# EAGLE schematic bike-blinky (EAGLE 6.4)
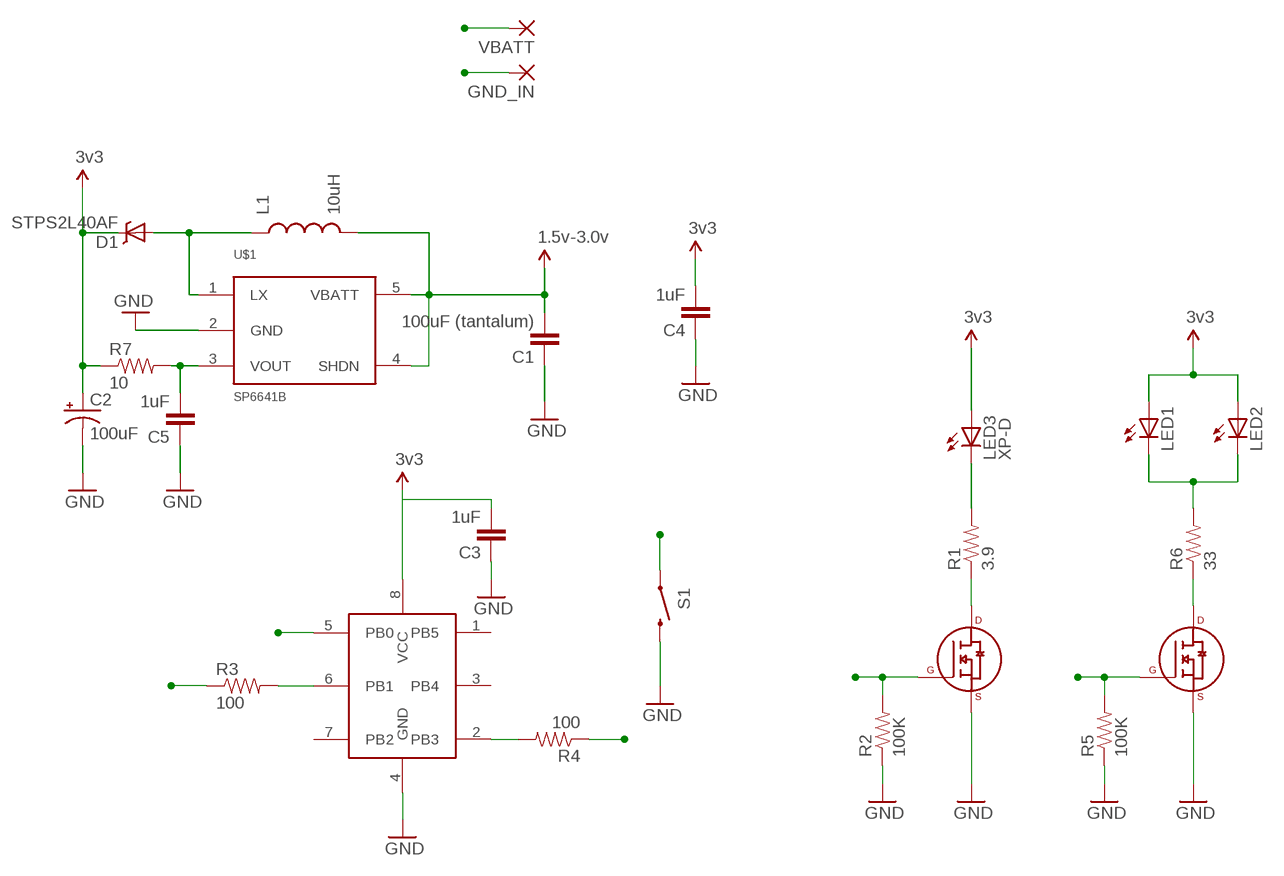
[diagram p0: schematic, sheet 1]

## Parts
C1  100uF (tantalum)  CAP1206  [1206]
C2  100uF  CAP_POLC  [PANASONIC_C]
C3  1uF  CAP0603-CAP  [0603-CAP]
C4  1uF  CAP0603-CAP  [0603-CAP]
C5  1uF  CAP0603-CAP  [0603-CAP]
D1  STPS2L40AF  MBRA140  [SMA-DIODE]
GND_IN  WIREPAD2,54/1,0  [2,54/1,0]
L1  10uH  INDUCTOR1007  [1007]
LED1  LED3MM  [LED3MM]
LED2  LED3MM  [LED3MM]
LED3  XP-D  XLAMP-XB-D-LED  [XB-D-REV1]
R1  3.9  RESISTOR0603-RES  [0603-RES]
R2  100K  RESISTOR0603-RES  [0603-RES]
R3  100  RESISTOR0603-RES  [0603-RES]
R4  100  RESISTOR0603-RES  [0603-RES]
R5  100K  RESISTOR0603-RES  [0603-RES]
R6  33  RESISTOR0603-RES  [0603-RES]
R7  10  RESISTOR0603-RES  [0603-RES]
S1  SWITCH-MOMENTARY-2SMD-2  [TACTILE_SWITCH_SMD-2]
U$1  SP6641B  SP6641SP6641A/B  [SOT23-5]
U$2  ATTINY13  [WSOIC-8]
U$7  NDS351AN  [SOT-23-3]
U$8  NDS351AN  [SOT-23-3]
VBATT  WIREPAD2,54/1,0  [2,54/1,0]

## Nets
5V: C2.+ C3.2 C4.2 D1.C LED1.A LED2.A LED3.A R7.1 U$2.8(VCC) ; supply symbol labelled 3v3
GND: C1.1 C2.- C3.1 C4.1 C5.1 GND_IN.1(P) R2.1 R5.1 S1.1 U$1.2(GND) U$2.4(GND) U$7.2(S) U$8.2(S)
GND_OUT: R1.1 U$8.3(D)
GND_OUT1: R6.1 U$7.3(D)
N$2: R3.2 U$2.6(PB1)
N$3: D1.A L1.1 U$1.1(LX)
N$4: LED1.K(C) LED2.K(C) R6.2
N$5: LED3.C R1.2
N$6: R4.2 U$2.2(PB3)
N$7: C5.2 R7.2 U$1.3(VOUT)
RED: R2.2 R3.1 U$8.1(G)
SW: S1.2 U$2.5(PB0)
VBATT: C1.2 L1.2 U$1.4(SHDN) U$1.5(VBATT) VBATT.1(P) ; supply symbol labelled 1.5v-3.0v
YEL: R4.1 R5.2 U$7.1(G)
Unconnected: U$2.1(PB5) U$2.3(PB4) U$2.7(PB2)

## Library data of the parts
C1 C3-C5 = SparkFun:CAP: Capacitor Standard 0603 ceramic capacitor, and 0.1" leaded capacitor.
C2 = SparkFun-Capacitors:CAP_POL: Capacitor Polarized These are standard SMD and PTH capacitors. Normally 10uF, 47uF, and 100uF in electrolytic and tantalum varieties. Always verify the external diameter of the through hole cap, it varies with capacity, voltage, and manufacturer. The EIA devices should be standard.
D1 = SparkFun-DiscreteSemi:MBRA140: 40V, 1A Schottky rectifier SMA/DO-214AC package DIO-08053; PROD_ID: DIO-08053
GND_IN VBATT = wirepad:WIREPAD: Wire PAD connect wire on PCB
L1 = SparkFun-Passives:INDUCTOR: Inductors Basic Inductor/Choke - 0603 and 1206. Footprints are not proven and vary greatly between part numbers.
LED1 LED2 = SparkFun-LED:LED: LEDs Standard schematic elements and footprints for 5mm, 3mm, 1206, and 0603 sized LEDs. 5mm - Spark Fun Electronics SKU : COM-00529 (and others)
LED3 = led_cree:XLAMP-XB-D-LED
R1-R6 = SparkFun:RESISTOR: Resistor Basic schematic elements and footprints for 0603, 1206, and PTH resistors.
R7 = SparkFun-Passives:RESISTOR: Resistor Basic schematic elements and footprints for 0603, 1206, and PTH resistors.
S1 = SparkFun-Electromechanical:SWITCH-MOMENTARY-2: Various NO switches- pushbuttons, reed, etc
U$1 = Sipex Custom:SP6641
U$2 = Synapseware:ATTINY13
U$7 U$8 = Synapseware:NDS351AN: N-Channel, Logic Level, PowerTrench MOSFET